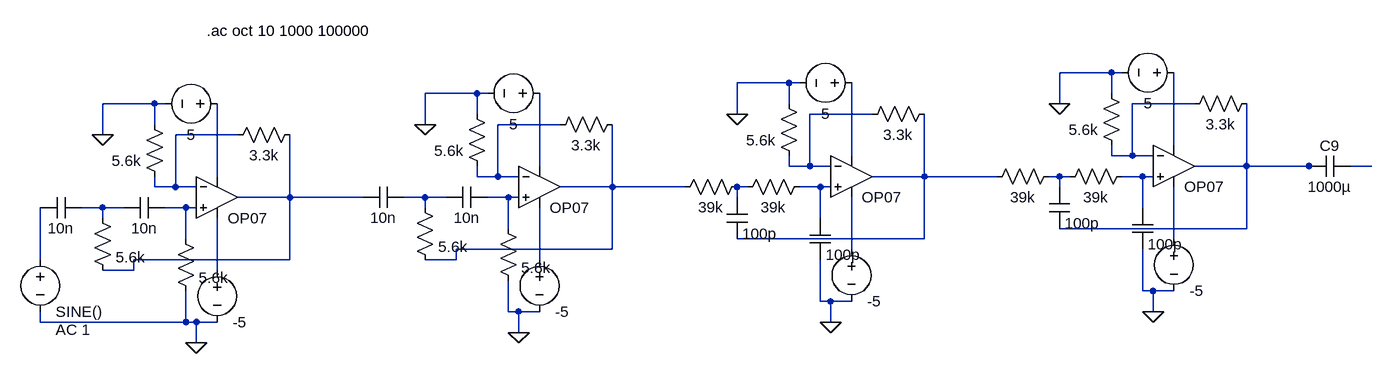
[diagram p0: schematic BPF.asc]
BPF.asc, the LTspice schematic file:
Version 4
SHEET 1 1908 680
WIRE 1504 -16 1424 -16
WIRE 1520 -16 1504 -16
WIRE 1008 0 928 0
WIRE 1024 0 1008 0
WIRE 528 16 448 16
WIRE 544 16 528 16
WIRE 1504 16 1504 -16
WIRE 32 32 -48 32
WIRE 48 32 32 32
WIRE 1008 32 1008 0
WIRE 1424 32 1424 -16
WIRE 1632 32 1536 32
WIRE 528 48 528 16
WIRE 928 48 928 0
WIRE 1136 48 1040 48
WIRE 32 64 32 32
WIRE 448 64 448 16
WIRE 656 64 560 64
WIRE -48 80 -48 32
WIRE 160 80 64 80
WIRE 1600 96 1600 -16
WIRE 1104 112 1104 0
WIRE 1504 112 1504 96
WIRE 1536 112 1536 32
WIRE 1536 112 1504 112
WIRE 1568 112 1536 112
WIRE 624 128 624 16
WIRE 1008 128 1008 112
WIRE 1040 128 1040 48
WIRE 1040 128 1008 128
WIRE 1072 128 1040 128
WIRE 1712 128 1712 32
WIRE 1712 128 1632 128
WIRE 1808 128 1712 128
WIRE 1824 128 1808 128
WIRE 1904 128 1872 128
WIRE 128 144 128 32
WIRE 528 144 528 128
WIRE 560 144 560 64
WIRE 560 144 528 144
WIRE 592 144 560 144
WIRE 1216 144 1216 48
WIRE 1216 144 1136 144
WIRE 1328 144 1216 144
WIRE 1424 144 1408 144
WIRE 1440 144 1424 144
WIRE 1552 144 1520 144
WIRE 1568 144 1552 144
WIRE 32 160 32 144
WIRE 64 160 64 80
WIRE 64 160 32 160
WIRE 96 160 64 160
WIRE 736 160 736 64
WIRE 736 160 656 160
WIRE 848 160 736 160
WIRE 944 160 928 160
WIRE 1056 160 1024 160
WIRE 1072 160 1056 160
WIRE 1424 160 1424 144
WIRE 240 176 240 80
WIRE 240 176 160 176
WIRE 352 176 240 176
WIRE 448 176 416 176
WIRE 480 176 448 176
WIRE 576 176 544 176
WIRE 592 176 576 176
WIRE 928 176 928 160
WIRE -48 192 -80 192
WIRE -16 192 -48 192
WIRE 80 192 48 192
WIRE 96 192 80 192
WIRE 448 192 448 176
WIRE 1552 192 1552 144
WIRE -48 208 -48 192
WIRE 1056 208 1056 160
WIRE 576 224 576 176
WIRE 1712 224 1712 128
WIRE 1712 224 1424 224
WIRE 80 240 80 192
WIRE 1216 240 1216 144
WIRE 1216 240 928 240
WIRE 1600 240 1600 160
WIRE 736 256 736 160
WIRE 736 256 496 256
WIRE 1104 256 1104 176
WIRE -144 272 -144 192
WIRE 240 272 240 176
WIRE 240 272 0 272
WIRE 496 272 496 256
WIRE 496 272 448 272
WIRE 624 272 624 192
WIRE 0 288 0 272
WIRE 0 288 -48 288
WIRE 128 288 128 208
WIRE 1552 320 1552 256
WIRE 1568 320 1552 320
WIRE 1600 320 1568 320
WIRE 1056 336 1056 272
WIRE 1072 336 1056 336
WIRE 1104 336 1072 336
WIRE 576 352 576 304
WIRE 592 352 576 352
WIRE 624 352 592 352
WIRE 1568 352 1568 320
WIRE -144 368 -144 352
WIRE 80 368 80 320
WIRE 80 368 -144 368
WIRE 96 368 80 368
WIRE 128 368 96 368
WIRE 1072 368 1072 336
WIRE 592 384 592 352
WIRE 96 400 96 368
FLAG 96 400 0
FLAG -48 80 0
FLAG 592 384 0
FLAG 448 64 0
FLAG 1072 368 0
FLAG 928 48 0
FLAG 1568 352 0
FLAG 1424 32 0
SYMBOL Opamps\\OP07 128 112 R0
WINDOW 0 16 32 Invisible 2
SYMATTR InstName U1
SYMBOL res 256 64 R90
WINDOW 0 0 56 Invisible 2
WINDOW 3 32 56 VTop 2
SYMATTR InstName R3
SYMATTR Value 3.3k
SYMBOL res 48 160 R180
WINDOW 0 36 76 Invisible 2
WINDOW 3 36 40 Left 2
SYMATTR InstName R4
SYMATTR Value 5.6k
SYMBOL voltage 144 32 R90
WINDOW 0 -32 56 Invisible 2
WINDOW 3 32 56 VTop 2
WINDOW 123 0 0 Left 2
WINDOW 39 0 0 Left 2
SYMATTR InstName V1
SYMATTR Value 5
SYMBOL voltage 128 272 R0
WINDOW 0 24 16 Invisible 2
WINDOW 123 0 0 Left 2
WINDOW 39 0 0 Left 2
SYMATTR InstName V2
SYMATTR Value -5
SYMBOL voltage -144 256 R0
WINDOW 0 24 16 Invisible 2
WINDOW 123 24 124 Left 2
WINDOW 39 0 0 Left 2
SYMATTR InstName V3
SYMATTR Value2 AC 1
SYMATTR Value SINE()
SYMBOL cap -80 176 R90
WINDOW 0 0 32 Invisible 2
WINDOW 3 32 32 VTop 2
SYMATTR InstName C6
SYMATTR Value 10n
SYMBOL cap 48 176 R90
WINDOW 0 0 32 Invisible 2
WINDOW 3 32 32 VTop 2
SYMATTR InstName C7
SYMATTR Value 10n
SYMBOL res -64 192 R0
WINDOW 0 36 40 Invisible 2
SYMATTR InstName R1
SYMATTR Value 5.6k
SYMBOL res 64 224 R0
WINDOW 0 36 40 Invisible 2
SYMATTR InstName R2
SYMATTR Value 5.6k
SYMBOL Opamps\\OP07 624 96 R0
WINDOW 0 16 32 Invisible 2
SYMATTR InstName U2
SYMBOL res 752 48 R90
WINDOW 0 0 56 Invisible 2
WINDOW 3 32 56 VTop 2
SYMATTR InstName R5
SYMATTR Value 3.3k
SYMBOL res 544 144 R180
WINDOW 0 36 76 Invisible 2
WINDOW 3 36 40 Left 2
SYMATTR InstName R6
SYMATTR Value 5.6k
SYMBOL voltage 640 16 R90
WINDOW 0 -32 56 Invisible 2
WINDOW 3 32 56 VTop 2
WINDOW 123 0 0 Left 2
WINDOW 39 0 0 Left 2
SYMATTR InstName V4
SYMATTR Value 5
SYMBOL voltage 624 256 R0
WINDOW 0 24 16 Invisible 2
WINDOW 123 0 0 Left 2
WINDOW 39 0 0 Left 2
SYMATTR InstName V5
SYMATTR Value -5
SYMBOL cap 416 160 R90
WINDOW 0 0 32 Invisible 2
WINDOW 3 32 32 VTop 2
SYMATTR InstName C1
SYMATTR Value 10n
SYMBOL cap 544 160 R90
WINDOW 0 0 32 Invisible 2
WINDOW 3 32 32 VTop 2
SYMATTR InstName C2
SYMATTR Value 10n
SYMBOL res 432 176 R0
WINDOW 0 36 40 Invisible 2
SYMATTR InstName R7
SYMATTR Value 5.6k
SYMBOL res 560 208 R0
WINDOW 0 36 40 Invisible 2
SYMATTR InstName R8
SYMATTR Value 5.6k
SYMBOL Opamps\\OP07 1104 80 R0
WINDOW 0 16 32 Invisible 2
SYMATTR InstName U3
SYMBOL res 1232 32 R90
WINDOW 0 0 56 Invisible 2
WINDOW 3 32 56 VTop 2
SYMATTR InstName R9
SYMATTR Value 3.3k
SYMBOL res 1024 128 R180
WINDOW 0 36 76 Invisible 2
WINDOW 3 36 40 Left 2
SYMATTR InstName R10
SYMATTR Value 5.6k
SYMBOL voltage 1120 0 R90
WINDOW 0 -32 56 Invisible 2
WINDOW 3 32 56 VTop 2
WINDOW 123 0 0 Left 2
WINDOW 39 0 0 Left 2
SYMATTR InstName V6
SYMATTR Value 5
SYMBOL voltage 1104 240 R0
WINDOW 0 24 16 Invisible 2
WINDOW 123 0 0 Left 2
WINDOW 39 0 0 Left 2
SYMATTR InstName V7
SYMATTR Value -5
SYMBOL Opamps\\OP07 1600 64 R0
WINDOW 0 16 32 Invisible 2
SYMATTR InstName U4
SYMBOL res 1728 16 R90
WINDOW 0 0 56 Invisible 2
WINDOW 3 32 56 VTop 2
SYMATTR InstName R13
SYMATTR Value 3.3k
SYMBOL res 1520 112 R180
WINDOW 0 36 76 Invisible 2
WINDOW 3 36 40 Left 2
SYMATTR InstName R14
SYMATTR Value 5.6k
SYMBOL voltage 1616 -16 R90
WINDOW 0 -32 56 Invisible 2
WINDOW 3 32 56 VTop 2
WINDOW 123 0 0 Left 2
WINDOW 39 0 0 Left 2
SYMATTR InstName V9
SYMATTR Value 5
SYMBOL voltage 1600 224 R0
WINDOW 0 24 16 Invisible 2
WINDOW 123 0 0 Left 2
WINDOW 39 0 0 Left 2
SYMATTR InstName V10
SYMATTR Value -5
SYMBOL cap 1040 208 R0
WINDOW 0 24 8 Invisible 2
SYMATTR InstName C3
SYMATTR Value 100p
SYMBOL cap 1536 192 R0
WINDOW 0 24 8 Invisible 2
SYMATTR InstName C4
SYMATTR Value 100p
SYMBOL res 944 144 R90
WINDOW 0 0 56 Invisible 2
WINDOW 3 32 56 VTop 2
SYMATTR InstName R11
SYMATTR Value 39k
SYMBOL res 1424 128 R90
WINDOW 0 0 56 Invisible 2
WINDOW 3 32 56 VTop 2
SYMATTR InstName R12
SYMATTR Value 39k
SYMBOL res 1040 144 R90
WINDOW 0 0 56 Invisible 2
WINDOW 3 32 56 VTop 2
SYMATTR InstName R15
SYMATTR Value 39k
SYMBOL res 1536 128 R90
WINDOW 0 0 56 Invisible 2
WINDOW 3 32 56 VTop 2
SYMATTR InstName R16
SYMATTR Value 39k
SYMBOL cap 912 176 R0
WINDOW 0 24 8 Invisible 2
SYMATTR InstName C5
SYMATTR Value 100p
SYMBOL cap 1408 160 R0
WINDOW 0 24 8 Invisible 2
SYMATTR InstName C8
SYMATTR Value 100p
SYMBOL cap 1872 112 R90
WINDOW 0 0 32 VBottom 2
WINDOW 3 32 32 VTop 2
SYMATTR InstName C9
SYMATTR Value 1000µ
TEXT 112 -80 Left 2 !.ac oct 10 1000 100000

The netlist it stands for:
* BPF.asc
XU1 N021 N004 N010 N026 N017 LT1001  ; OP07, pins In+ In- V+ V- OUT
R3 N017 N004 3.3k
R4 N004 0 5.6k
V1 N010 0 5
V2 N026 0 -5
V3 N024 0 SINE() AC 1
C6 N020 N024 10n
C7 N021 N020 10n
R1 N020 N017 5.6k
R2 N021 0 5.6k
XU2 N019 N003 N007 N025 N014 LT1001  ; OP07, pins In+ In- V+ V- OUT
R5 N014 N003 3.3k
R6 N003 0 5.6k
V4 N007 0 5
V5 N025 0 -5
C1 N018 N017 10n
C2 N019 N018 10n
R7 N018 N014 5.6k
R8 N019 0 5.6k
XU3 N016 N002 N006 N023 N011 LT1001  ; OP07, pins In+ In- V+ V- OUT
R9 N011 N002 3.3k
R10 N002 0 5.6k
V6 N006 0 5
V7 N023 0 -5
XU4 N013 N001 N005 N022 N008 LT1001  ; OP07, pins In+ In- V+ V- OUT
R13 N008 N001 3.3k
R14 N001 0 5.6k
V9 N005 0 5
V10 N022 0 -5
C3 N016 0 100p
C4 N013 0 100p
R11 N015 N014 39k
R12 N012 N011 39k
R15 N016 N015 39k
R16 N013 N012 39k
C5 N015 N011 100p
C8 N012 N008 100p
C9 N009 N008 1000µ
.ac oct 10 1000 100000
.lib LTC.lib
.backanno
.end